# Altium project Audio_testboard.PrjPcb (part 3 of 3)

## Sheet XLR.SchDoc
size A3; SheetNumber: 2; SheetTotal: 2
Used 4 times, as channels XLR1, XLR2, XLR3, XLR4. Parts and nets are listed once, with the designators drawn on the sheet.
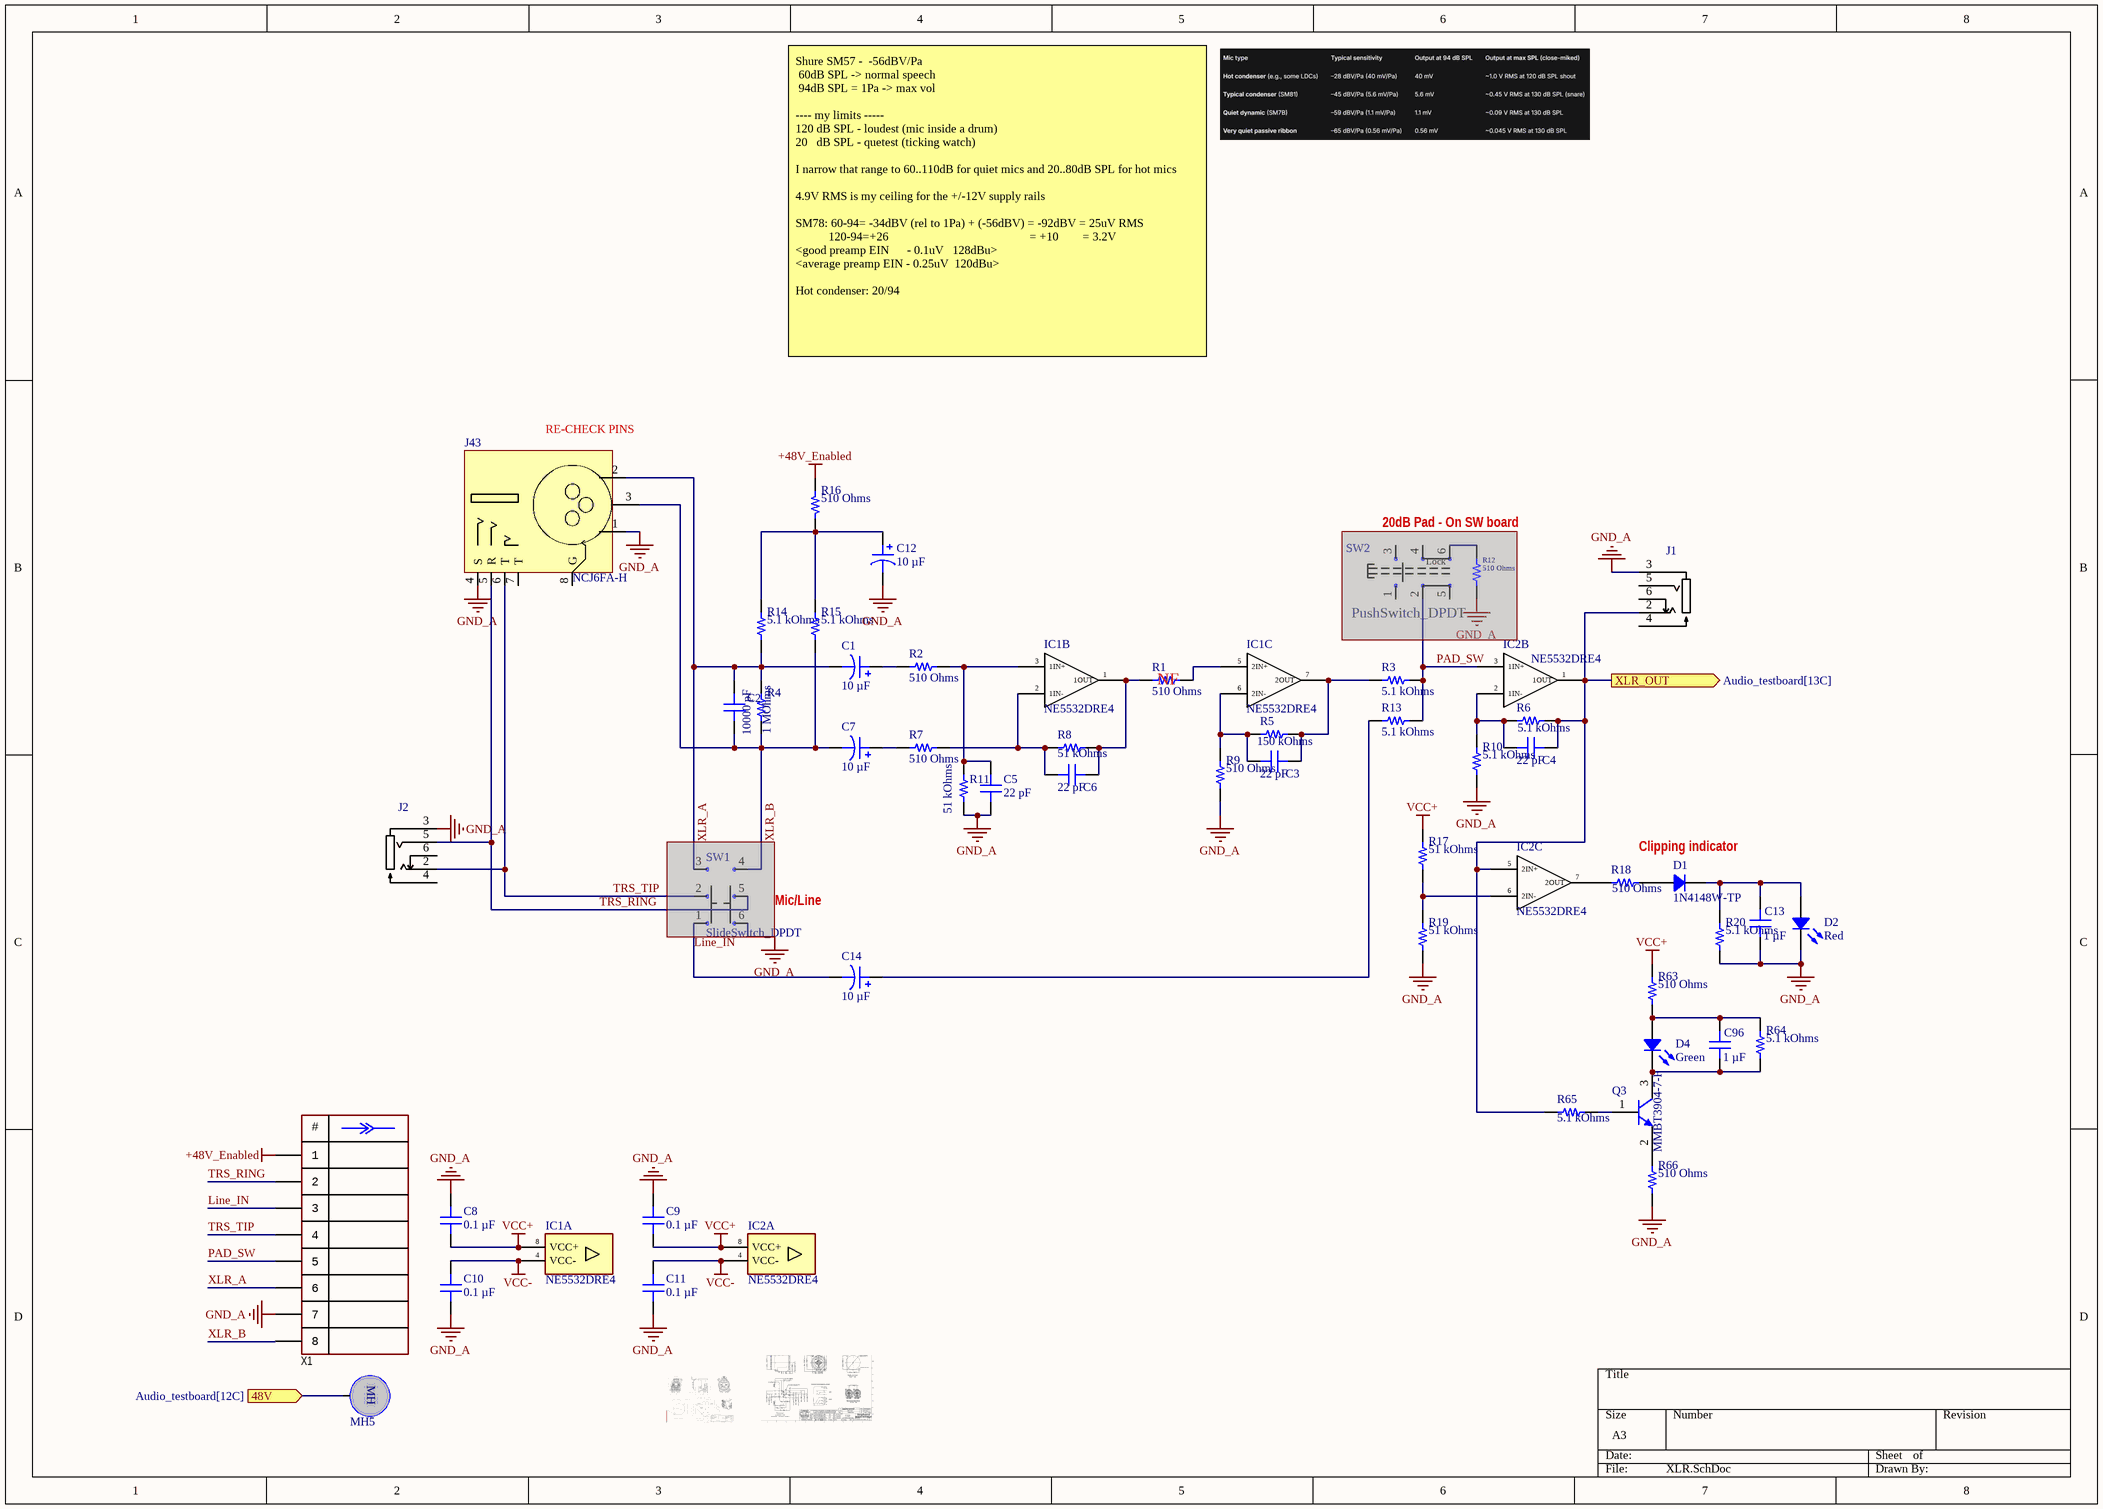
[diagram p6: XLR.SchDoc]

### Parts
C1  10 µF  [CAP POL 1206_3216]
C2  10000 pF  [CAP 0603_1608]
C3  22 pF  [CAP 0603_1608]
C4  22 pF  [CAP 0603_1608]
C5  22 pF  [CAP 0603_1608]
C6  22 pF  [CAP 0603_1608]
C7  10 µF  [CAP POL 1206_3216]
C8  0.1 µF  [CAP 0603_1608]
C9  0.1 µF  [CAP 0603_1608]
C10  0.1 µF  [CAP 0603_1608]
C11  0.1 µF  [CAP 0603_1608]
C12  10 µF  [CAP POL 1206_3216]
C13  1 µF  [CAP 0805_2012]
C14  10 µF  [CAP POL 1206_3216]
C96  1 µF  [CAP 0805_2012]
D1  1N4148W-TP  [SOD-123]
D2  Red  [LED 0805_2012 RED]
D4  Green  [LED 0805_2012 GREEN]
IC1  NE5532DRE4  [SOIC127P600X175-8N]  (parts A,B,C of 3)
IC2  NE5532DRE4  [SOIC127P600X175-8N]  (parts A,B,C of 3)
J1  35RASMT2BHNTRX  [PJ_327]  (value not drawn)
J2  35RASMT2BHNTRX  [PJ_327]  (value not drawn)
J43  NCJ6FA-H  [ACJC10HL]
MH5  MountingHole  [Hole_2.5mm]  (value not drawn)
Q3  MMBT3904-7-F  [DIODES SOT-23-3]
R1  510 Ohms  [RES 0603_1608]
R2  510 Ohms  [RES 0603_1608]
R3  5.1 kOhms  [RES 0603_1608]
R4  1 MOhms  [RES 0603_1608]
R5  150 kOhms  [RES 0603_1608]
R6  5.1 kOhms  [RES 0603_1608]
R7  510 Ohms  [RES 0603_1608]
R8  51 kOhms  [RES 0603_1608]
R9  510 Ohms  [RES 0603_1608]
R10  5.1 kOhms  [RES 0603_1608]
R11  51 kOhms  [RES 0603_1608]
R12  510 Ohms  [YAGEO RES 0603_1608]  (masked out: inside a compile mask, not in the netlist)
R13  5.1 kOhms  [RES 0603_1608]
R14  5.1 kOhms  [RES 0603_1608]
R15  5.1 kOhms  [RES 0603_1608]
R16  510 Ohms  [RES 0603_1608]
R17  51 kOhms  [RES 0603_1608]
R18  510 Ohms  [RES 0603_1608]
R19  51 kOhms  [RES 0603_1608]
R20  5.1 kOhms  [RES 0603_1608]
R63  510 Ohms  [RES 0603_1608]
R64  5.1 kOhms  [RES 0603_1608]
R65  5.1 kOhms  [RES 0603_1608]
R66  510 Ohms  [RES 0603_1608]
SW1  SlideSwitch_DPDT  [SK-22F03-G060]  (masked out: inside a compile mask, not in the netlist)
SW2  PushSwitch_DPDT  [TK-6580A-1]  (masked out: inside a compile mask, not in the netlist)
X1  (no value)  [CON: PLD-8]

### Ports
48V (in, see Audio_testboard[12C]), XLR_OUT (out, see Audio_testboard[13C])

### Nets
+48V_Enabled: R16.2 X1.1
GND_A: C5.1 C8.2 C9.2 C10.1 C11.1 C12.2 C13.1 D2.2 J1.3 J2.3 J43.1 J43.4(S) R9.1 R10.1 R11.1 R19.2 R20.1 R66.1 X1.7
VCC+: C8.1 C9.1 IC1.8(VCC+) IC2.8(VCC+) R17.1 R63.2
VCC-: C10.2 C11.2 IC1.4(VCC-) IC2.4(VCC-)
48V: MH5.0 ; port 48V
Line_IN: C14.2 X1.3
PAD_SW: IC2.3(1IN+) R3.2 R13.2 X1.5
TRS_RING: J2.5 J43.5(R) X1.2
TRS_TIP: J2.2 J43.6(T) X1.4
XLR_A: C1.2 C2.2 J43.2 R4.1 R14.1 X1.6
XLR_B: C2.1 C7.2 J43.3 R4.2 R15.1 X1.8
XLR_OUT: C4.1 IC2.1(1OUT) IC2.5(2IN+) J1.2 R6.2 R65.2 ; port XLR_OUT
NetC1_1: C1.1 R2.1
NetC3_1: C3.1 IC1.7(2OUT) R3.1 R5.2
NetC3_2: C3.2 IC1.6(2IN-) R5.1 R9.2
NetC4_2: C4.2 IC2.2(1IN-) R6.1 R10.2
NetC5_2: C5.2 IC1.3(1IN+) R2.2 R11.2
NetC6_1: C6.1 IC1.1(1OUT) R1.1 R8.1
NetC6_2: C6.2 IC1.2(1IN-) R7.2 R8.2
NetC7_1: C7.1 R7.1
NetC12_1: C12.1 R14.2 R15.2 R16.1
NetC13_2: C13.2 D1.2 D2.1 R20.2
NetC14_1: C14.1 R13.1
NetC96_1: C96.1 D4.2 Q3.3(C) R64.1
NetC96_2: C96.2 D4.1 R63.1 R64.2
NetD1_1: D1.1 R18.2
NetIC1_5: IC1.5(2IN+) R1.2
NetIC2_6: IC2.6(2IN-) R17.2 R19.1
NetIC2_7: IC2.7(2OUT) R18.1
NetQ3_1: Q3.1(B) R65.1
NetQ3_2: Q3.2(E) R66.2

Not connected (* = marked no-connect by the designer): J1 4(5) 5(3) 6(4); J2 4(5) 6(4); J43 7(T) 8(G)

### Channels
XLR1: designators end in _XLR1; ports 48V=+48V XLR_OUT=LIN1
XLR2: designators end in _XLR2; ports 48V=+48V XLR_OUT=RIN1
XLR3: designators end in _XLR3; ports 48V=+48V XLR_OUT=LIN2
XLR4: designators end in _XLR4; ports 48V=+48V XLR_OUT=RIN2

### Notes on the sheet
- Shure SM57 -  -56dBV/Pa
  60dB SPL -> normal speech
  94dB SPL = 1Pa -> max vol
  ---- my limits -----
  120 dB SPL - loudest (mic inside a drum)
  20   dB SPL - quetest (ticking watch)
  I narrow that range to 60..110dB for quiet mics and 20..80dB SPL for hot mics
  4.9V RMS is my ceiling for the +/-12V supply rails
  SM78: 60-94= -34dBV (rel to 1Pa) + (-56dBV) = -92dBV = 25uV RMS
  120-94=+26                                               = +10        = 3.2V
  <good preamp EIN      - 0.1uV   128dBu>
  <average preamp EIN - 0.25uV  120dBu>
  Hot condenser: 20/94
- (near J43) RE-CHECK PINS
- 20dB Pad - On SW board
- (near R1) NF
- Clipping indicator
- (near SW1) Mic/Line
- (in symbol MountingHole) MH
- (in symbol PLD-8) #
- (in symbol PushSwitch_DPDT) Lock

### Library data of the parts
C1 C7 C12 C14 = T491A106K010AT: CAP TANT 10UF 10% 10V 1206; manufacturer: KEMET; Manufacturer Size Code: A; ESR (Equivalent Series Resistance): 3.8Ohm; Lifetime @ Temp.: 2000 Hrs @ 125°C; Type: Molded; Part Number: T491A106K010AT; Value: 10 µF; Capacitance: 10 µF; componentlink1description: Datasheet; componentlink1url: https://api.kemet.com/component-edge/download/datasheet/T491A106K010AT.pdf; componentlink2description: DigiKey Link; componentlink2url: https://www.digikey.com/en/products/detail/kemet/T491A106K010AT/818545; Device Package: 1206 (3216 Metric); Features: General Purpose; Height - Seated (Max): 0.071" (1.80mm); lastupdated: 4/5/2026 8:12:52 PM; Lifecycle Status: Active; Minimum Order: 1; Mounting Type: Surface Mount; Operating Temperature: -55°C ~ 125°C; Package / Case: 1206 (3216 Metric); packaging: TapeAndReel; partid: 330; Part Status: Active; price: 0.09; series: T491; Size / Dimension: 0.126" L x 0.063" W (3.20mm x 1.60mm); Supplier 1: DigiKey; Supplier Part Number 1: 399-3684-1-ND; Tolerance: ±10%; Voltage - Rated: 10 V
C2 = GRM1885C1H103JA01D: CAP CER 10000PF 50V C0G/NP0 0603; manufacturer: Murata Electronics; Temperature Coefficient: C0G, NP0; Tolerance: ±5%; Part Number: GRM1885C1H103JA01D; Capacitance: 10000 pF; Applications: General Purpose; componentlink1description: Datasheet; componentlink1url: https://www.murata.com/~/media/webrenewal/support/library/catalog/products/capacitor/mlcc/c02e.ashx?la=en-us; componentlink2description: DigiKey Link; componentlink2url: https://www.digikey.com/en/products/detail/murata-electronics/GRM1885C1H103JA01D/4421555; Device Package: 0603 (1608 Metric); lastupdated: 4/6/2026 7:23:21 PM; Lifecycle Status: Active; Minimum Order: 1; Mounting Type: Surface Mount, MLCC; Operating Temperature: -55°C ~ 125°C; Package / Case: 0603 (1608 Metric); packaging: TapeAndReel; partid: 11077; Part Status: Active; price: 0.02; series: GRM; Size / Dimension: 0.063" L x 0.031" W (1.60mm x 0.80mm); Supplier 1: DigiKey; Supplier Part Number 1: 490-9666-1-ND; Thickness (Max): 0.035" (0.90mm); value: 10000 pF; Voltage - Rated: 50V
C3-C6 = CC0603GRNPO9BN220: CAP CER 22PF 50V C0G/NPO 0603; manufacturer: Yageo; Temperature Coefficient: C0G, NP0; Tolerance: ±2%; Part Number: CC0603GRNPO9BN220; Capacitance: 22 pF; Applications: General Purpose; componentlink1description: Datasheet; componentlink1url: https://www.yageo.com/upload/media/product/productsearch/datasheet/mlcc/UPY-GP_NP0_16V-to-50V_17.pdf; componentlink2description: DigiKey Link; componentlink2url: https://www.digikey.com/en/products/detail/yageo/CC0603GRNPO9BN220/5883550; Device Package: 0603 (1608 Metric); lastupdated: 4/6/2026 7:23:47 PM; Lifecycle Status: Active; Minimum Order: 1; Mounting Type: Surface Mount, MLCC; Operating Temperature: -55°C ~ 125°C; Package / Case: 0603 (1608 Metric); packaging: TapeAndReel; partid: 3677; Part Status: Active; price: 0.01; series: CC; Size / Dimension: 0.063" L x 0.031" W (1.60mm x 0.80mm); Supplier 1: DigiKey; Supplier Part Number 1: 311-3925-1-ND; Thickness (Max): 0.035" (0.90mm); value: 22 pF; Voltage - Rated: 50V
C8-C11 = C0603C104K5RAC7411: CAP CER 0.1UF 50V X7R 0603; manufacturer: KEMET; Tolerance: ±10%; Part Number: C0603C104K5RAC7411; value: 0.1 µF; Applications: Bypass, Decoupling; Capacitance: 0.1 µF; componentlink1description: Datasheet; componentlink1url: https://api.kemet.com/component-edge/download/datasheet/C0603C104K5RAC7411.pdf; componentlink2description: DigiKey Link; componentlink2url: https://www.digikey.com/en/products/detail/kemet/C0603C104K5RAC7411/3317013; Device Package: 0603 (1608 Metric); lastupdated: 4/6/2026 7:23:52 PM; Lifecycle Status: Active; Minimum Order: 1; Mounting Type: Surface Mount, MLCC; Operating Temperature: -55°C ~ 125°C; Package / Case: 0603 (1608 Metric); packaging: TapeAndReel; partid: 2233; Part Status: Active; price: 0.01; series: SMD Comm X7R; Size / Dimension: 0.063" L x 0.031" W (1.60mm x 0.80mm); Supplier 1: DigiKey; Supplier Part Number 1: 399-C0603C104K5RAC7411CT-ND; Temperature Coefficient: X7R; Thickness (Max): 0.035" (0.90mm); Voltage - Rated: 50V
C13 C96 = C0805C105K4RAC7800: CAP CER 1UF 16V X7R 0805; manufacturer: KEMET; Tolerance: ±10%; Part Number: C0805C105K4RAC7800; value: 1 µF; Applications: Bypass, Decoupling; Capacitance: 1 µF; componentlink1description: Datasheet; componentlink1url: https://api.kemet.com/component-edge/download/datasheet/C0805C105K4RACTU.pdf; componentlink2description: DigiKey Link; componentlink2url: https://www.digikey.com/en/products/detail/kemet/C0805C105K4RAC7800/416047; Device Package: 0805 (2012 Metric); lastupdated: 4/6/2026 7:31:58 PM; Lifecycle Status: Active; Minimum Order: 1; Mounting Type: Surface Mount, MLCC; Operating Temperature: -55°C ~ 125°C; Package / Case: 0805 (2012 Metric); packaging: TapeAndReel; partid: 32075; Part Status: Active; price: 0.01; series: SMD Comm X7R; Size / Dimension: 0.079" L x 0.049" W (2.00mm x 1.25mm); Supplier 1: DigiKey; Supplier Part Number 1: 399-C0805C105K4RAC7800CT-ND; Temperature Coefficient: X7R; Thickness (Max): 0.039" (1.00mm); Voltage - Rated: 16V
D1 = 1N4148W-TP: DIODE GEN PURP 100V 150MA SOD123; Manufacturer: Micro Commercial Co; Capacitance @ Vr, F: 2pF @ 0V, 1MHz; Current - Reverse Leakage @ Vr: 1 µA @ 75 V; Diode Type: Standard; Reverse Recovery Time (trr): 4 ns; Speed: Small Signal =< 200mA (Io), Any Speed; Voltage - Forward (Vf) (Max) @ If: 1.25 V @ 150 mA; Part Number: 1N4148W-TP; ComponentLink1Description: Datasheet; ComponentLink1URL: https://www.mccsemi.com/pdf/Products/1N4148W(SOD123).pdf; ComponentLink2Description: DigiKey Link; ComponentLink2URL: https://www.digikey.com/en/products/detail/micro-commercial-co/1N4148W-TP/717196; Current - Average Rectified (Io): 150mA; LastUpdated: 4/5/2026 8:31:46 PM; Lifecycle Status: Active; Minimum Order: 1; Mounting Type: Surface Mount; Operating Temperature - Junction: -65°C ~ 150°C; Package / Case: SOD-123; Packaging: TapeAndReel; PartId: 999; Part Status: Active; Price: 0.01; Series: -; Supplier 1: DigiKey; Supplier Part Number 1: 1N4148WTPMSCT-ND; Supplier Device Package: SOD-123; Voltage - DC Reverse (Vr) (Max): 100 V
D2 = LSM0805412V: LED RED CLEAR 0805 SMD; Manufacturer: Visual Communications Company - VCC; Configuration: 0805; Current - Test: 20mA; Lens Color: Colorless; Lens Size: 1.40mm x 1.20mm; Lens Style: Rectangle with Flat Top; Millicandela Rating: 100mcd; Viewing Angle: 120°; Voltage - Forward (Vf) (Typ): 2V; Wavelength - Dominant: 625nm; Part Number: LSM0805412V; Color: Red; ComponentLink1Description: Datasheet; ComponentLink1URL: https://www.vcclite.com/wp-content/uploads/wpallimport/files/files/LSM0805452V-Green-Datasheet.pdf; ComponentLink2Description: DigiKey Link; ComponentLink2URL: https://www.digikey.com/en/products/detail/visual-communications-company-vcc/LSM0805412V/10229616; Device Package: 0805 (2012 Metric); Height (Max): 0.90mm; LastUpdated: 4/5/2026 8:38:27 PM; Lens Transparency: Clear; Lifecycle Status: Active; Minimum Order: 1; Mounting Type: Surface Mount; Package / Case: 0805 (2012 Metric); Packaging: TapeAndReel; PartId: 336; Part Status: Active; Price: 0.10; Series: LSM0805; Size / Dimension: 2.00mm L x 1.25mm W; Supplier 1: DigiKey; Supplier Part Number 1: 28-LSM0805412VCT-ND; Supplier Device Package: 0805; Value: Red; Wavelength - Peak: 625nm
D4 = QTLP630C4TR: LED GREEN CLEAR 0805 SMD; Manufacturer: Everlight Electronics Co Ltd; Configuration: Standard; Current - Test: 20mA; Lens Color: Colorless; Lens Size: 1.40mm x 1.25mm; Lens Style: Rectangle with Flat Top; Millicandela Rating: 10mcd; Viewing Angle: 140°; Voltage - Forward (Vf) (Typ): 2.1V; Wavelength - Peak: 565nm; Wavelength - Dominant: 570nm; Part Number: QTLP630C4TR; Color: Green; ComponentLink1Description: Datasheet; ComponentLink1URL: //media.digikey.com/PDF/Data%20Sheets/Everlight%20PDFs/QTLP630-2.pdf; ComponentLink2Description: DigiKey Link; ComponentLink2URL: https://www.digikey.com/en/products/detail/everlight-electronics-co-ltd/QTLP630C4TR/2675902; Device Package: 0805 (2012 Metric); Height (Max): 1.20mm; LastUpdated: 4/5/2026 8:39:04 PM; Lens Transparency: Clear; Lifecycle Status: Active; Minimum Order: 1; Mounting Type: Surface Mount; Package / Case: 0805 (2012 Metric); Packaging: TapeAndReel; PartId: 240; Part Status: Active; Price: 0.05; Series: -; Size / Dimension: 2.00mm L x 1.25mm W; Supplier 1: DigiKey; Supplier Part Number 1: 1080-1411-1-ND; Value: Green; Supplier Device Package: 0805
IC1 IC2 = NE5532DRE4: Integrated Circuit; Manufacturer_Name: Texas Instruments; Datasheet Link: https://www.ti.com/lit/ds/symlink/ne5532.pdf?HQS=dis-mous-null-mousermode-dsf-pf-null-wwe&ts=1618482303902&ref_url=https%253A%252F%252Fwww.mouser.com%252F; Height: 1.75mm; Manufacturer_Part_Number: NE5532DRE4; Mouser Part Number: 595-NE5532DRE4; Mouser Price/Stock: https://www.mouser.co.uk/ProductDetail/Texas-Instruments/NE5532DRE4?qs=7nS3%252BbEUL6spPf9Rt7S6cg%3D%3D; Arrow Part Number: NE5532DRE4; Arrow Price/Stock: https://www.arrow.com/en/products/ne5532dre4/texas-instruments
J1 J2 = 3.5mm jack stereo smd: Conn 3.5MM Stereo Jack F 3 POS Solder RA SMD 3 Terminal 1 Port T/R PJ-327; MF: Switchcraft; MP: 35RASMT2BHNTRX; Package: None; Price: 0.84 USD; Availability: Good; SnapEDA_Link: https://www.snapeda.com/parts/35RASMT2BHNTRX/Switchcraft%20Inc./view-part/?ref=snap; Value: *
J43 = NCJ6FA-H: XLR Neutrik NCJ6FA-H
Q3 = MMBT3904-7-F: TRANS NPN 40V 0.2A SOT-23-3; Manufacturer: Diodes Incorporated; Current - Collector Cutoff (Max): 50nA (ICBO); Current - Collector (Ic) (Max): 200 mA; DC Current Gain (hFE) (Min) @ Ic, Vce: 100 @ 10mA, 1V; Frequency - Transition: 300MHz; Power - Max: 300 mW; Vce Saturation (Max) @ Ib, Ic: 300mV @ 5mA, 50mA; Part Number: MMBT3904-7-F; ComponentLink1Description: Datasheet; ComponentLink1URL: https://www.diodes.com/assets/Datasheets/ds30036.pdf; ComponentLink2Description: DigiKey Link; ComponentLink2URL: https://www.digikey.com/en/products/detail/diodes-incorporated/MMBT3904-7-F/814494; LastUpdated: 4/5/2026 9:03:01 PM; Lifecycle Status: Active; Minimum Order: 1; Mounting Type: Surface Mount; Operating Temperature: -55°C ~ 150°C (TJ); Package / Case: TO-236-3, SC-59, SOT-23-3; Packaging: TapeAndReel; PartId: 85; Part Status: Active; Price: 0.01; Series: -; Supplier 1: DigiKey; Supplier Part Number 1: MMBT3904-FDICT-ND; Supplier Device Package: SOT-23-3; Transistor Type: NPN; Voltage - Collector Emitter Breakdown (Max): 40 V
R1 R2 R7 R9 R12 R16 R18 R63 R66 = AC0603FR-07510RL: RES SMD 510 OHM 1% 1/10W 0603; Manufacturer: Yageo; Power (Watts): 0.1W, 1/10W; Temperature Coefficient: ±100ppm/°C; Part Number: AC0603FR-07510RL; Value: 510 Ohms; ComponentLink1Description: Datasheet; ComponentLink1URL: https://www.yageo.com/upload/media/product/productsearch/datasheet/rchip/PYu-AC_51_RoHS_L_7.pdf; ComponentLink2Description: DigiKey Link; ComponentLink2URL: https://www.digikey.com/en/products/detail/yageo/AC0603FR-07510RL/5896175; Composition: Thick Film; Device Package: 0603 (1608 Metric); Features: Automotive AEC-Q200, Moisture Resistant; Height - Seated (Max): 0.022" (0.55mm); Lifecycle Status: Active; Minimum Order: 1; Number of Terminations: 2; Operating Temperature: -55°C ~ 155°C; Package / Case: 0603 (1608 Metric); Packaging: CutTape; PartId: 15979; Part Status: Active; Price: 0.01; Ratings: AEC-Q200; Resistance: 510 Ohms; Series: AC; Size / Dimension: 0.063" L x 0.031" W (1.60mm x 0.80mm); Supplier 1: DigiKey; Supplier Part Number 1: YAG3615CT-ND; Supplier Device Package: 0603; Tolerance: ±1%
  R1 R2 R7 R9 R16 R18 R63 R66: LastUpdated: 4/6/2026 7:43:51 PM
  R12: LastUpdated: 7/25/2024 9:19:25 AM
R3 R6 R10 R13-R15 R20 R64 R65 = AC0603FR-075K1L: RES SMD 5.1K OHM 1% 1/10W 0603; Manufacturer: Yageo; Power (Watts): 0.1W, 1/10W; Temperature Coefficient: ±100ppm/°C; Part Number: AC0603FR-075K1L; Value: 5.1 kOhms; ComponentLink1Description: Datasheet; ComponentLink1URL: https://www.yageo.com/upload/media/product/productsearch/datasheet/rchip/PYu-AC_51_RoHS_L_7.pdf; ComponentLink2Description: DigiKey Link; ComponentLink2URL: https://www.digikey.com/en/products/detail/yageo/AC0603FR-075K1L/5896209; Composition: Thick Film; Device Package: 0603 (1608 Metric); Features: Automotive AEC-Q200, Moisture Resistant; Height - Seated (Max): 0.022" (0.55mm); LastUpdated: 4/6/2026 7:43:48 PM; Lifecycle Status: Active; Minimum Order: 1; Number of Terminations: 2; Operating Temperature: -55°C ~ 155°C; Package / Case: 0603 (1608 Metric); Packaging: CutTape; PartId: 17442; Part Status: Active; Price: 0.01; Ratings: AEC-Q200; Resistance: 5.1 kOhms; Series: AC; Size / Dimension: 0.063" L x 0.031" W (1.60mm x 0.80mm); Supplier 1: DigiKey; Supplier Part Number 1: YAG3621CT-ND; Supplier Device Package: 0603; Tolerance: ±1%
R4 = ERJ-3EKF1004V: RES SMD 1M OHM 1% 1/10W 0603; Manufacturer: Panasonic Electronic Components; Power (Watts): 0.1W, 1/10W; Temperature Coefficient: ±100ppm/°C; Part Number: ERJ-3EKF1004V; Value: 1 MOhms; ComponentLink1Description: Datasheet; ComponentLink1URL: https://industrial.panasonic.com/cdbs/www-data/pdf/RDA0000/AOA0000C304.pdf; ComponentLink2Description: DigiKey Link; ComponentLink2URL: https://www.digikey.com/en/products/detail/panasonic-electronic-components/ERJ-3EKF1004V/196033; Composition: Thick Film; Device Package: 0603 (1608 Metric); Height - Seated (Max): 0.022" (0.55mm); LastUpdated: 2/9/2024 8:42:00 PM; Lifecycle Status: Active; Minimum Order: 1; Number of Terminations: 2; Operating Temperature: -55°C ~ 155°C; Package / Case: 0603 (1608 Metric); Packaging: TapeAndReel; PartId: 25691; Part Status: Active; Price: 0.01; Resistance: 1 MOhms; Series: ERJ-3EK; Size / Dimension: 0.063" L x 0.031" W (1.60mm x 0.80mm); Supplier 1: DigiKey; Supplier Part Number 1: P1.00MHCT-ND; Supplier Device Package: 0603; Tolerance: ±1%; Features: Automotive AEC-Q200; Ratings: AEC-Q200
R5 = AC0603FR-07150KL: RES SMD 150K OHM 1% 1/10W 0603; Manufacturer: Yageo; Power (Watts): 0.1W, 1/10W; Temperature Coefficient: ±100ppm/°C; Part Number: AC0603FR-07150KL; Value: 150 kOhms; ComponentLink1Description: Datasheet; ComponentLink1URL: https://www.yageo.com/upload/media/product/productsearch/datasheet/rchip/PYu-AC_51_RoHS_L_7.pdf; ComponentLink2Description: DigiKey Link; ComponentLink2URL: https://www.digikey.com/en/products/detail/yageo/AC0603FR-07150KL/5895795; Composition: Thick Film; Device Package: 0603 (1608 Metric); Features: Automotive AEC-Q200, Moisture Resistant; Height - Seated (Max): 0.022" (0.55mm); LastUpdated: 4/6/2026 7:43:48 PM; Lifecycle Status: Active; Minimum Order: 1; Number of Terminations: 2; Operating Temperature: -55°C ~ 155°C; Package / Case: 0603 (1608 Metric); Packaging: CutTape; PartId: 17374; Part Status: Active; Price: 0.01; Ratings: AEC-Q200; Resistance: 150 kOhms; Series: AC; Size / Dimension: 0.063" L x 0.031" W (1.60mm x 0.80mm); Supplier 1: DigiKey; Supplier Part Number 1: YAG3567CT-ND; Supplier Device Package: 0603; Tolerance: ±1%
R8 R11 R17 R19 = AC0603FR-0751KL: RES SMD 51K OHM 1% 1/10W 0603; Manufacturer: Yageo; Power (Watts): 0.1W, 1/10W; Temperature Coefficient: ±100ppm/°C; Part Number: AC0603FR-0751KL; Value: 51 kOhms; ComponentLink1Description: Datasheet; ComponentLink1URL: https://www.yageo.com/upload/media/product/productsearch/datasheet/rchip/PYu-AC_51_RoHS_L_7.pdf; ComponentLink2Description: DigiKey Link; ComponentLink2URL: https://www.digikey.com/en/products/detail/yageo/AC0603FR-0751KL/5896179; Composition: Thick Film; Device Package: 0603 (1608 Metric); Features: Automotive AEC-Q200, Moisture Resistant; Height - Seated (Max): 0.022" (0.55mm); LastUpdated: 4/6/2026 7:43:48 PM; Lifecycle Status: Active; Minimum Order: 1; Number of Terminations: 2; Operating Temperature: -55°C ~ 155°C; Package / Case: 0603 (1608 Metric); Packaging: CutTape; PartId: 17419; Part Status: Active; Price: 0.01; Ratings: AEC-Q200; Resistance: 51 kOhms; Series: AC; Size / Dimension: 0.063" L x 0.031" W (1.60mm x 0.80mm); Supplier 1: DigiKey; Supplier Part Number 1: YAG3616CT-ND; Supplier Device Package: 0603; Tolerance: ±1%
X1 = PLD-8: Manufacturer: Connfly; ValueManufacturerPartNumber: Connector, 8pin, 2.54mm, 500VAC, 3A; TypeConnector: Connector; VoltageMax: 500VAC; Pitch: 2.54mm; CurrentMax: 3A; Multichannel: 8pin; CommentText: "Разъем"; HelpURL: https://www.chipdip.ru/product/pld-8-ds1021-2x4; PartNumber: PLD-8

## Nets that join several sheets
+48V: Audio_testboard (C93.2 C94.2 D3.2 R45.2), XLR1 (MH5_XLR1.0), XLR2 (MH5_XLR2.0), XLR3 (MH5_XLR3.0), XLR4 (MH5_XLR4.0)
+48V_Enabled: XLR1 (R16_XLR1.2 X1_XLR1.1), XLR2 (R16_XLR2.2 X1_XLR2.1), XLR3 (R16_XLR3.2 X1_XLR3.1), XLR4 (R16_XLR4.2 X1_XLR4.1)
GND_A: Audio_testboard (57 pins), XLR1 (19 pins), XLR2 (19 pins), XLR3 (19 pins), XLR4 (19 pins)
VCC+: Audio_testboard (7 pins), XLR1 (6 pins), XLR2 (6 pins), XLR3 (6 pins), XLR4 (6 pins)
VCC-: Audio_testboard (7 pins), XLR1 (C10_XLR1.2 C11_XLR1.2 IC1_XLR1.4 IC2_XLR1.4), XLR2 (C10_XLR2.2 C11_XLR2.2 IC1_XLR2.4 IC2_XLR2.4), XLR3 (C10_XLR3.2 C11_XLR3.2 IC1_XLR3.4 IC2_XLR3.4), XLR4 (C10_XLR4.2 C11_XLR4.2 IC1_XLR4.4 IC2_XLR4.4)
LIN1: Audio_testboard (R1.1), XLR1 (6 pins)
LIN2: Audio_testboard (R2.1), XLR3 (6 pins)
RIN1: Audio_testboard (R5.1), XLR2 (6 pins)
RIN2: Audio_testboard (R6.1), XLR4 (6 pins)